# EAGLE design troostite_1.0v (EAGLE 6.5.0)
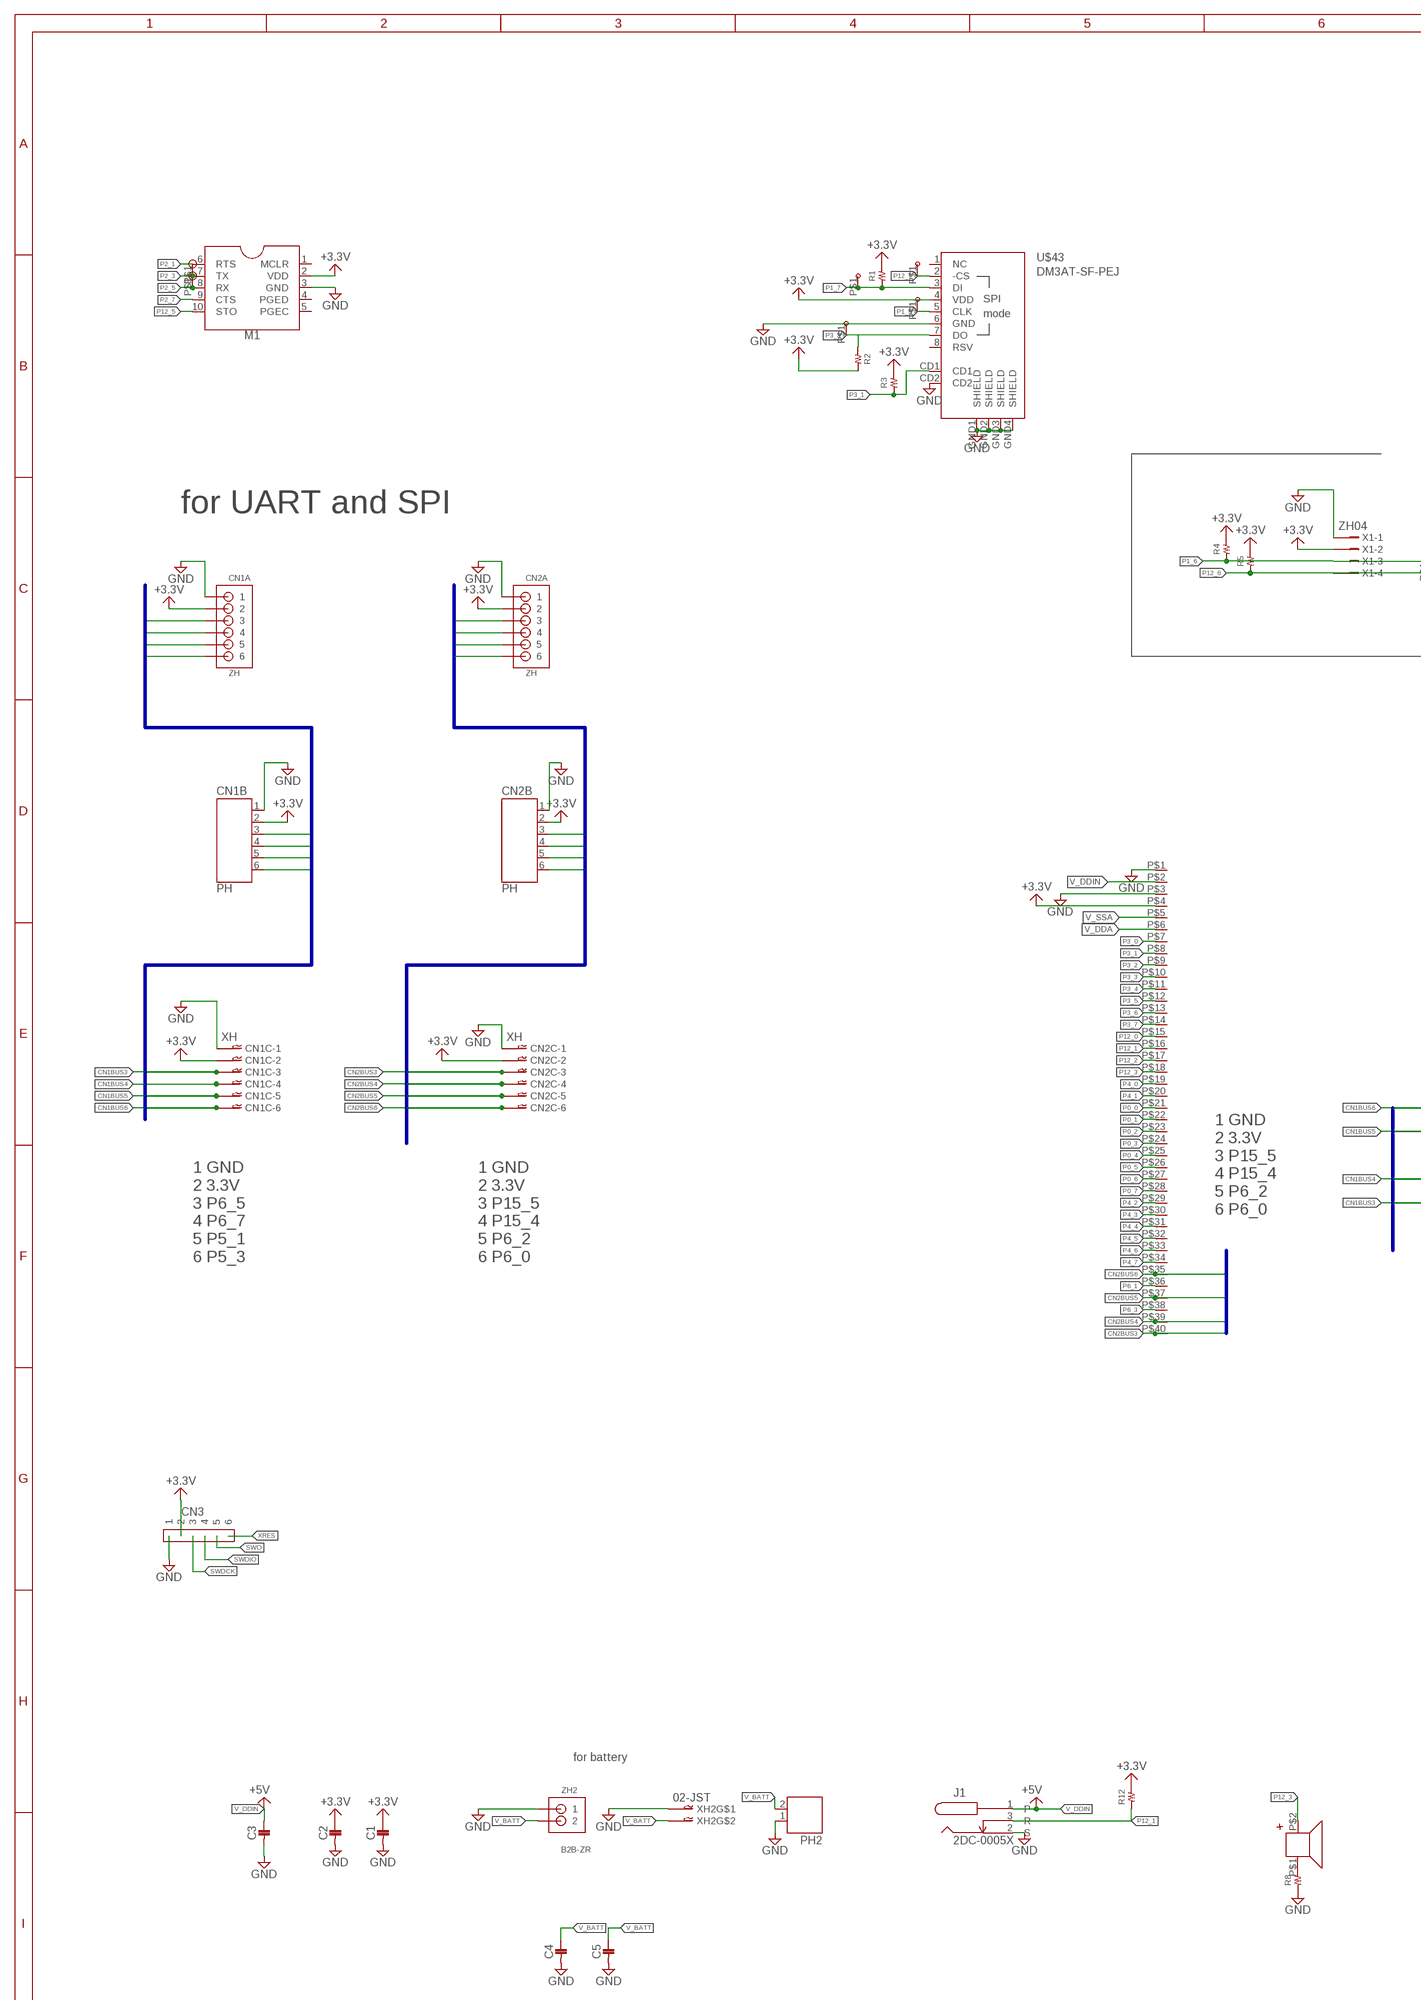
[diagram p0: schematic, sheet 1, part 1 of 2]
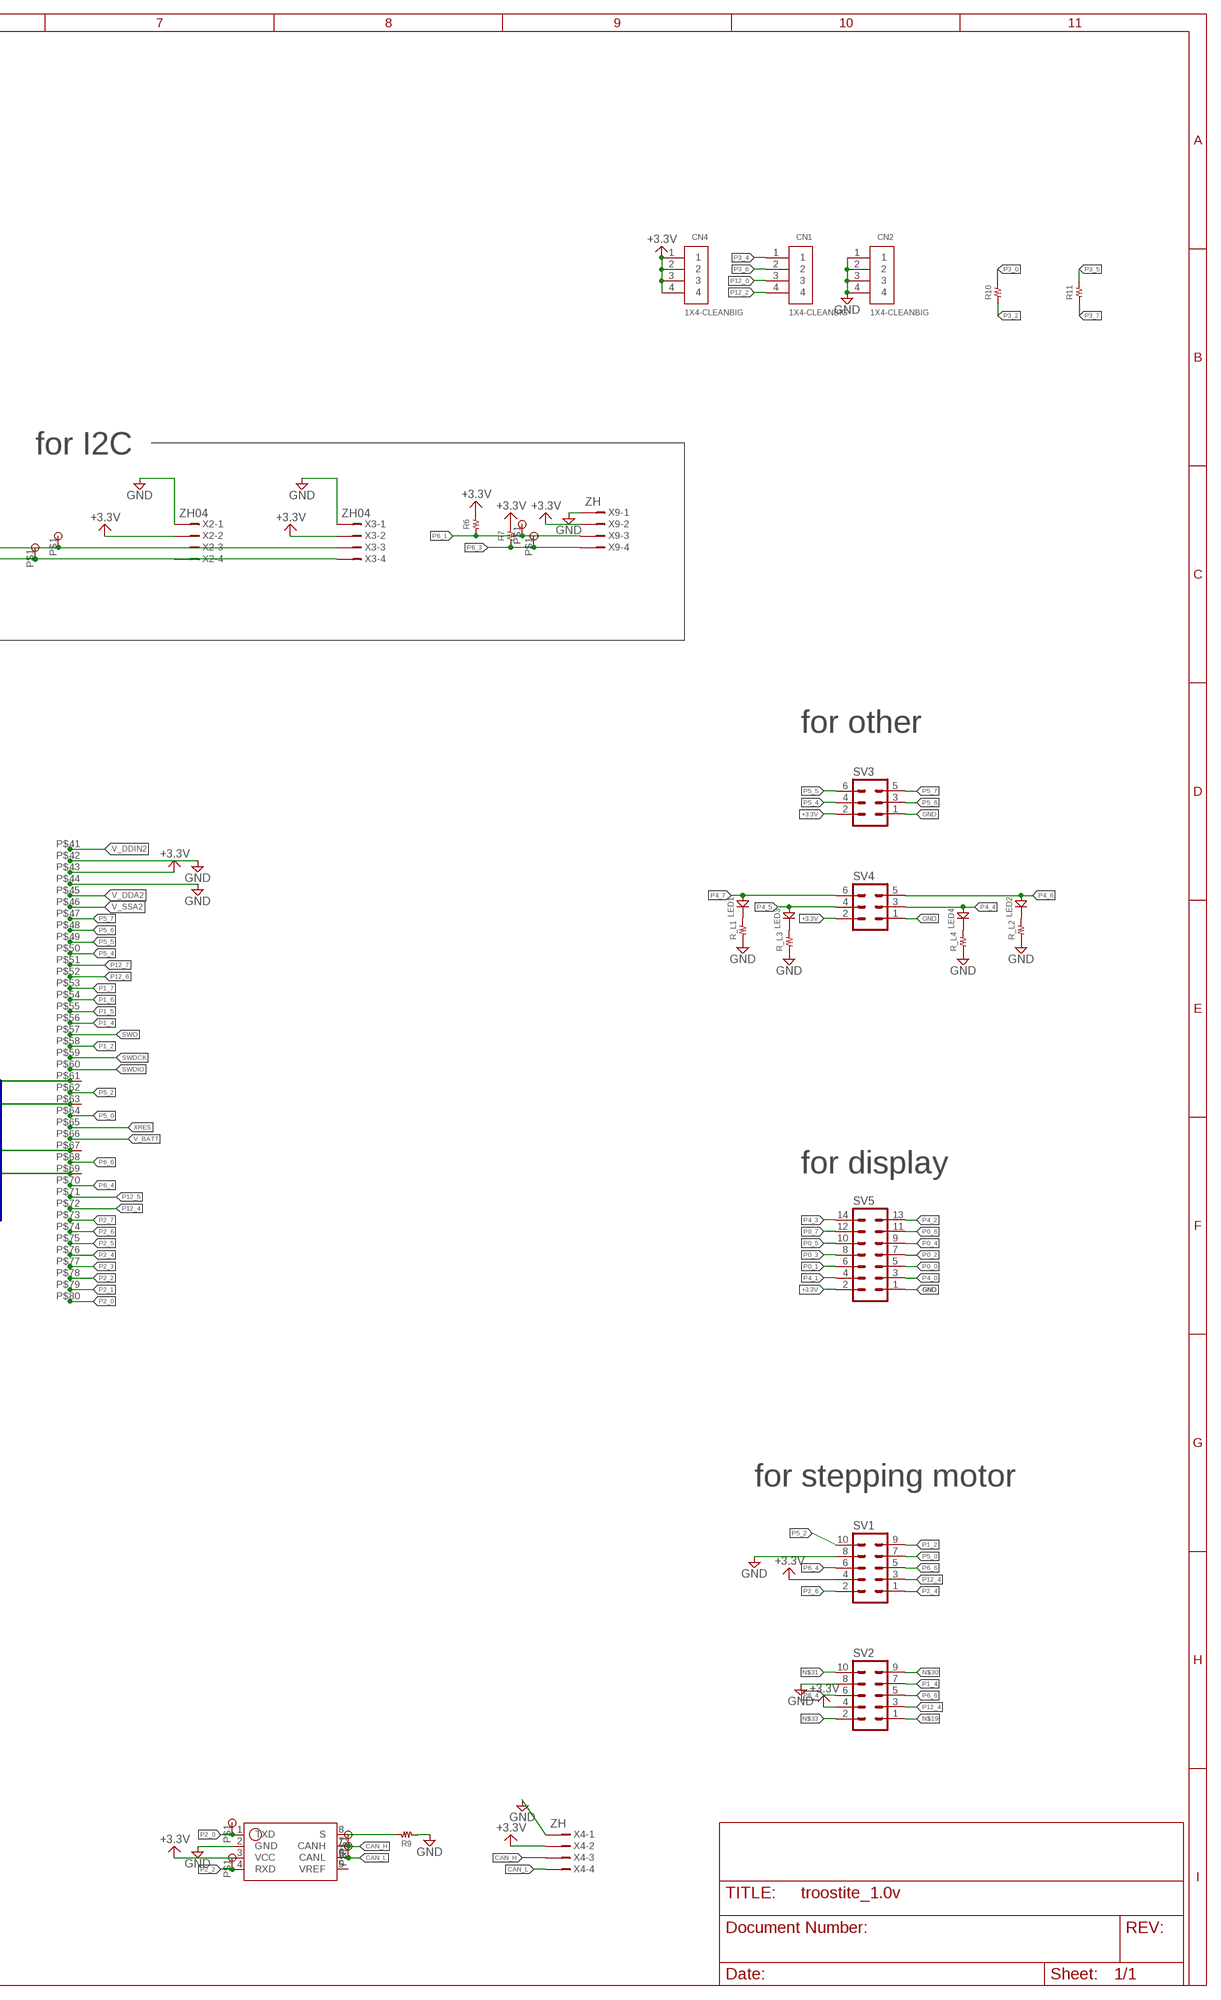
[diagram p1: schematic, sheet 1, part 2 of 2]

## Parts
C1  1608  [1608]
C2  1608  [1608]
C3  1608  [1608]
C4  1608  [1608]
C5  3225  [3225]
CN1  1X4-CLEANBIG  [1X04-CLEANBIG]
CN1A  ZH  B6B-ZR  [B6B-ZR]
CN1B  PH  JST-PH6  [JST-PH6]
CN1C  XH  06-JST-B6B-XH-A  [B6B-XH]
CN2  1X4-CLEANBIG  [1X04-CLEANBIG]
CN2A  ZH  B6B-ZR  [B6B-ZR]
CN2B  PH  JST-PH6  [JST-PH6]
CN2C  XH  06-JST-B6B-XH-A  [B6B-XH]
CN3  PIN_HEADER_6  [PIN_HEADER_6]
CN4  1X4-CLEANBIG  [1X04-CLEANBIG]
IC1  SN65HVD1050  [SOIC8]
J1  2DC-0005X  [2DC-0005D]
LED1  CHIPLED  [1608]
LED2  CHIPLED  [1608]
LED3  CHIPLED  [1608]
LED4  CHIPLED  [1608]
M1  SBDBT  [DIL10]
PH2  JST-PH2  [JST-PH2]
R1  RESISTOR__SMD  [1608]
R2  RESISTOR__SMD  [1608]
R3  RESISTOR__SMD  [1608]
R4  RESISTOR__SMD  [1608]
R5  RESISTOR__SMD  [1608]
R6  RESISTOR__SMD  [1608]
R7  RESISTOR__SMD  [1608]
R8  RESISTOR__SMD  [1608]
R9  RESISTOR__SMD  [1608]
R10  RESISTOR__SMD  [1608]
R11  RESISTOR__SMD  [1608]
R12  RESISTOR__SMD  [1608]
R_L1  RESISTOR__SMD  [1608]
R_L2  RESISTOR__SMD  [1608]
R_L3  RESISTOR__SMD  [1608]
R_L4  RESISTOR__SMD  [1608]
SV1  ML10  [ML10]
SV2  ML10  [ML10]
SV3  ML6  [ML6]
SV4  ML6  [ML6]
SV5  ML14  [ML14]
U$2  PSOC_5LP  [PSOC_5LP]
U$41  PKLCS1212E4001  [PKLCS1212E4001]
U$43  DM3AT-SF-PEJ  [DM3AT-SF-PEJ]
U$72  CHECK_0.8MM  [CHECK_0.8MM]
U$73  CHECK_0.8MM  [CHECK_0.8MM]
U$74  CHECK_0.8MM  [CHECK_0.8MM]
U$75  CHECK_0.8MM  [CHECK_0.8MM]
U$76  CHECK_0.8MM  [CHECK_0.8MM]
U$77  CHECK_0.8MM  [CHECK_0.8MM]
U$78  CHECK_0.8MM  [CHECK_0.8MM]
U$79  CHECK_0.8MM  [CHECK_0.8MM]
U$82  CHECK_0.8MM  [CHECK_0.8MM]
U$83  CHECK_0.8MM  [CHECK_0.8MM]
U$85  CHECK_21.3  [CHECK_2*1.3]
U$86  CHECK_21.3  [CHECK_2*1.3]
U$87  CHECK_21.3  [CHECK_2*1.3]
U$88  CHECK_21.3  [CHECK_2*1.3]
X1  ZH04  B4B-ZR  [B4B-ZR]
X2  ZH04  B4B-ZR  [B4B-ZR]
X3  ZH04  B4B-ZR  [B4B-ZR]
X4  ZH  B4B-ZR  [B4B-ZR]
X9  ZH  B4B-ZR  [B4B-ZR]
XH2  02-JST  [B2B-XH]
ZH2  B2B-ZR  [B2B-ZR]

## Nets
+3.3V: C1.P$1 C2.P$1 CN1A.2 CN1B.2 CN1C.P$2 CN2A.2 CN2B.2 CN2C.P$2 CN3.2 CN4.1 CN4.2 CN4.3 CN4.4 IC1.3(VCC) M1.2(VDD) R1.2 R2.2 R3.2 R4.2 R5.2 R6.2 R7.2 R12.2 SV1.4 SV2.4 SV3.2 SV4.2 SV5.2 U$2.P$4 U$2.P$43 U$43.4(VDD) X1.2 X2.2 X3.2 X4.2 X9.2
CAN_H: IC1.7(CANH) U$72.P$1 X4.3
CAN_L: IC1.6(CANL) U$73.P$1 X4.4
CN1BUS3: CN1A.3 CN1B.3 CN1C.P$3 U$2.P$69
CN1BUS4: CN1A.4 CN1B.4 CN1C.P$4 U$2.P$67
CN1BUS5: CN1A.5 CN1B.5 CN1C.P$5 U$2.P$63
CN1BUS6: CN1A.6 CN1B.6 CN1C.P$6 U$2.P$61
CN2BUS3: CN2A.3 CN2B.3 CN2C.P$3 U$2.P$40
CN2BUS4: CN2A.4 CN2B.4 CN2C.P$4 U$2.P$39
CN2BUS5: CN2A.5 CN2B.5 CN2C.P$5 U$2.P$37
CN2BUS6: CN2A.6 CN2B.6 CN2C.P$6 U$2.P$35
GND: C1.P$2 C2.P$2 C3.P$2 C4.P$2 C5.P$2 CN1A.1 CN1B.1 CN1C.P$1 CN2.1 CN2.2 CN2.3 CN2.4 CN2A.1 CN2B.1 CN2C.P$1 CN3.1 IC1.2(GND) J1.2(S) M1.3(GND) PH2.1 R8.1 R9.1 R_L1.1 R_L2.1 R_L3.1 R_L4.1 SV1.8 SV2.8 SV3.1 SV4.1 SV5.1 U$2.P$1 U$2.P$3 U$2.P$42 U$2.P$44 U$43.6(GND) U$43.CD2 U$43.GND1(SHIELD) U$43.GND2(SHIELD) U$43.GND3(SHIELD) U$43.GND4(SHIELD) X1.1 X2.1 X3.1 X4.1 X9.1 XH2.P$1 ZH2.1
N$1: R8.2 U$41.P$1(MINUS)
N$2: LED1.2(K) R_L1.2
N$3: LED3.2(K) R_L3.2
N$4: LED4.2(K) R_L4.2
N$5: LED2.2(K) R_L2.2
N$7: IC1.8(S) R9.2
N$19: SV2.1
N$30: SV2.9
N$31: SV2.10
N$33: SV2.2
P0_0: SV5.5 U$2.P$21
P0_1: SV5.6 U$2.P$22
P0_2: SV5.7 U$2.P$23
P0_3: SV5.8 U$2.P$24
P0_4: SV5.9 U$2.P$25
P0_5: SV5.10 U$2.P$26
P0_6: SV5.11 U$2.P$27
P0_7: SV5.12 U$2.P$28
P1_2: SV1.9 U$2.P$58
P1_4: SV2.7 U$2.P$56
P1_5: U$2.P$55 U$43.5(CLK) U$87.P$1
P1_6: R4.1 U$2.P$54 U$76.P$1 X1.3 X2.3 X3.3
P1_7: R1.1 U$2.P$53 U$43.3(DI) U$85.P$1
P2_0: IC1.1(TXD) U$2.P$80 U$74.P$1
P2_1: M1.6(RTS) U$2.P$79
P2_2: IC1.4(RXD) U$2.P$78 U$75.P$1
P2_3: M1.7(TX) U$2.P$77 U$82.P$1
P2_4: SV1.1 U$2.P$76
P2_5: M1.8(RX) U$2.P$75 U$83.P$1
P2_6: SV1.2 U$2.P$74
P2_7: M1.9(CTS) U$2.P$73
P3_0: R10.2 U$2.P$7
P3_1: R3.1 U$2.P$8 U$43.CD1
P3_2: R10.1 U$2.P$9
P3_3: R2.1 U$2.P$10 U$43.7(DO) U$88.P$1
P3_4: CN1.1 U$2.P$11
P3_5: R11.2 U$2.P$12
P3_6: CN1.2 U$2.P$13
P3_7: R11.1 U$2.P$14
P4_0: SV5.3 U$2.P$19
P4_1: SV5.4 U$2.P$20
P4_2: SV5.13 U$2.P$29
P4_3: SV5.14 U$2.P$30
P4_4: LED4.1(A) SV4.3 U$2.P$31
P4_5: LED3.1(A) SV4.4 U$2.P$32
P4_6: LED2.1(A) SV4.5 U$2.P$33
P4_7: LED1.1(A) SV4.6 U$2.P$34
P5_0: SV1.7 U$2.P$64
P5_2: SV1.10 U$2.P$62
P5_4: SV3.4 U$2.P$50
P5_5: SV3.6 U$2.P$49
P5_6: SV3.3 U$2.P$48
P5_7: SV3.5 U$2.P$47
P6_1: R6.1 U$2.P$36 U$78.P$1 X9.3
P6_3: R7.1 U$2.P$38 U$79.P$1 X9.4
P6_4: SV1.6 SV2.6 U$2.P$70
P6_6: SV1.5 SV2.5 U$2.P$68
P12_0: CN1.3 U$2.P$15
P12_1: J1.3(R) R12.1 U$2.P$16
P12_2: CN1.4 U$2.P$17
P12_3: U$2.P$18 U$41.P$2(PLUS)
P12_4: SV1.3 SV2.3 U$2.P$72
P12_5: M1.10(STO) U$2.P$71
P12_6: R5.1 U$2.P$52 U$77.P$1 X1.4 X2.4 X3.4
P12_7: U$2.P$51 U$43.2(-CS) U$86.P$1
SWDCK: CN3.3 U$2.P$59
SWDIO: CN3.4 U$2.P$60
SWO: CN3.5 U$2.P$57
V_BATT: C4.P$1 C5.P$1 PH2.2 U$2.P$66 XH2.P$2 ZH2.2
V_DDA: U$2.P$6
V_DDA2: U$2.P$45
V_DDIN: C3.P$1 J1.1(P) U$2.P$2 ; supply symbol labelled +5V
V_DDIN2: U$2.P$41
V_SSA: U$2.P$5
V_SSA2: U$2.P$46
XRES: CN3.6 U$2.P$65
Unconnected: IC1.5(VREF) M1.1(MCLR) M1.4(PGED) M1.5(PGEC) U$43.1(NC) U$43.8(RSV)

## Buses
CN1BUS[3..6]
CN2BUS[3..6]

## Notes on the sheet
- for I2C
- for UART and SPI
- for other
- for display
- 1 GND
  2 3.3V
  3 P15_5
  4 P15_4
  5 P6_2
  6 P6_0
- 1 GND
  2 3.3V
  3 P6_5
  4 P6_7
  5 P5_1
  6 P5_3
- 1 GND
  2 3.3V
  3 P15_5
  4 P15_4
  5 P6_2
  6 P6_0
- for stepping motor
- for battery

## Library data of the parts
C1-C4 = 02_C:1608
C5 = 02_C:3225
CN1 CN2 CN4 = adafruit:1X4: 4-pin connector
CN1A CN2A = jst:B6B-ZR: JST-ZH Connector 6 pol, 1.5mm pitch Package: B6B-ZR Source: http://www.jst-mfg.com/product/pdf/eng/eZH.pdf
CN1B CN2B = jst-ph:JST-PH6
CN1C CN2C = con-jst-xh:06-JST: JST CONNECTOR
CN3 = 08_CONECTOR:PIN_HEADER_6
IC1 = 04_IC:SN65HVD1050
J1 = marushin:2DC-0005X
LED1-LED4 = 10_LED:CHIPLED
M1 = 12_module:SBDBT
PH2 = jst-ph:JST-PH2
R1-R12 R_L1-R_L4 = 01_R:RESISTOR__SMD
SV1 SV2 = con-ml:ML10: HARTING; OC_FARNELL: unknown; OC_NEWARK: unknown
SV3 SV4 = con-ml:ML6: HARTING; OC_FARNELL: unknown; OC_NEWARK: unknown
SV5 = con-ml:ML14: HARTING; OC_FARNELL: unknown; OC_NEWARK: unknown
U$2 = 12_module:PSOC_5LP
U$41 = 13_SPEAKER:PKLCS1212E4001
U$43 = sd-card:DM3AT-SF-PEJ: HIROSE microSD socket DM3AT-SF-PEJ
U$72-U$79 U$82 U$83 = 08_CONECTOR:CHECK_0.8MM
U$85-U$88 = 08_CONECTOR:CHECK_2*1.3
X1-X4 X9 = con-jst:?4B-ZR: ZH CONNECTOR 1.5 mm, 4 pin 1 row Source: http://www.jst.com .. eZH.pdf; MF: FARNELL; MPN: B4B-ZR(LF)(SN); OC_FARNELL: 1830916; OC_NEWARK: 37K9960
XH2 = con-jst-xh:02-JST
ZH2 = jst:B2B-ZR

## Net classes
0 default: width 0.3 mm

## Board
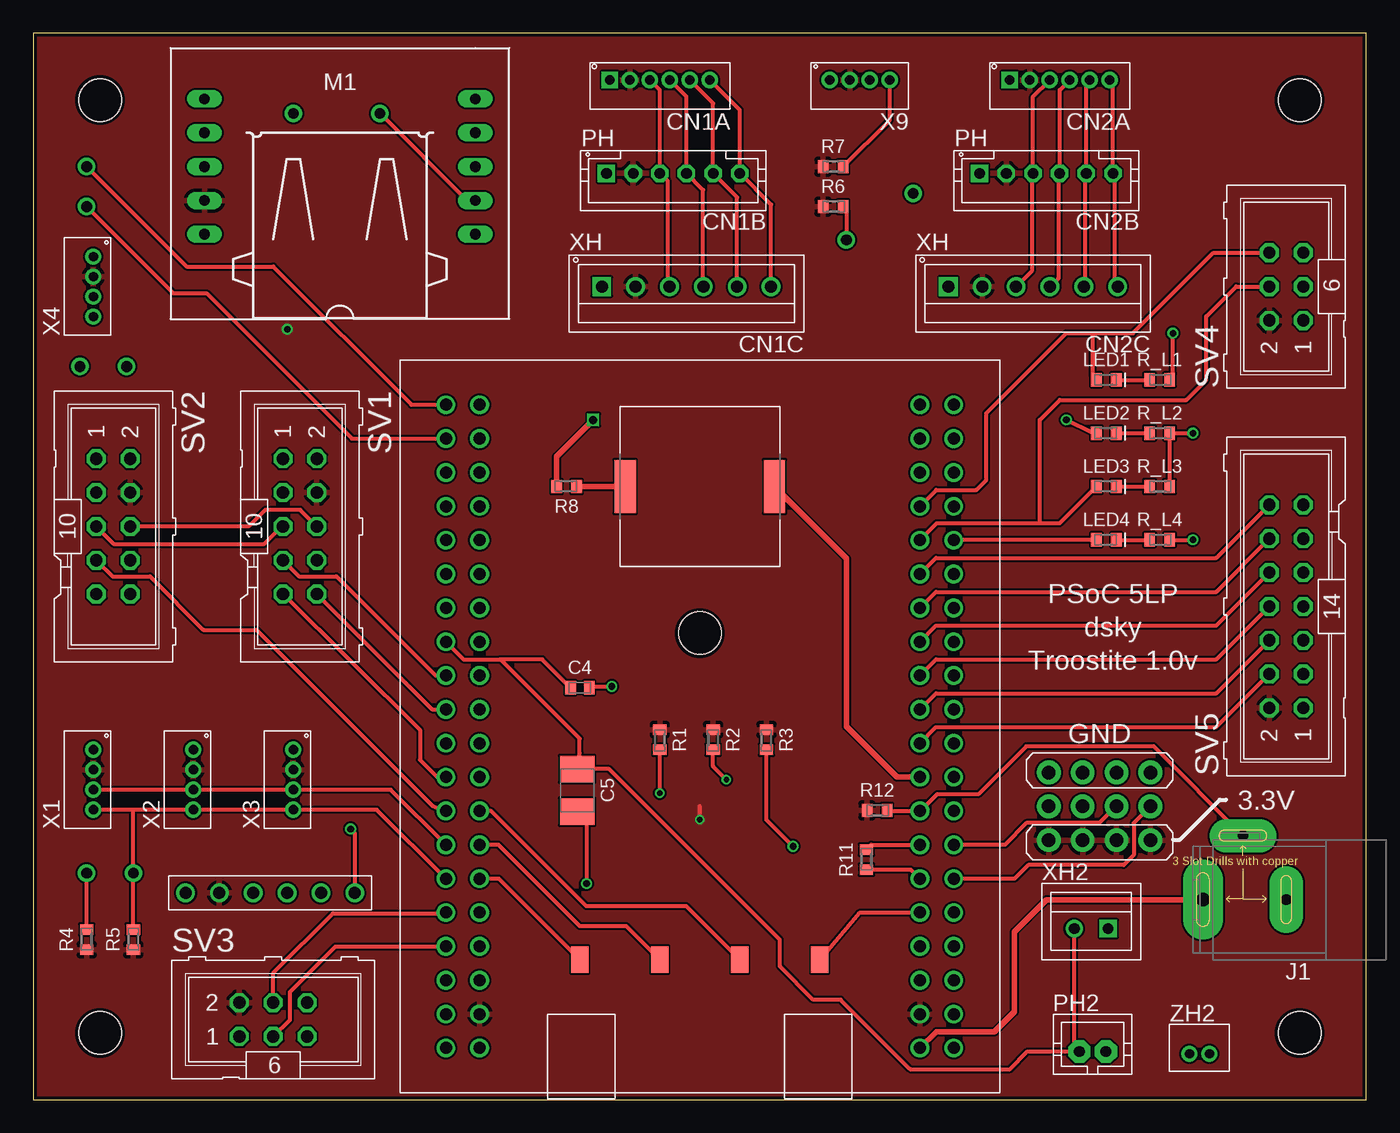
[diagram p2: board, top side]
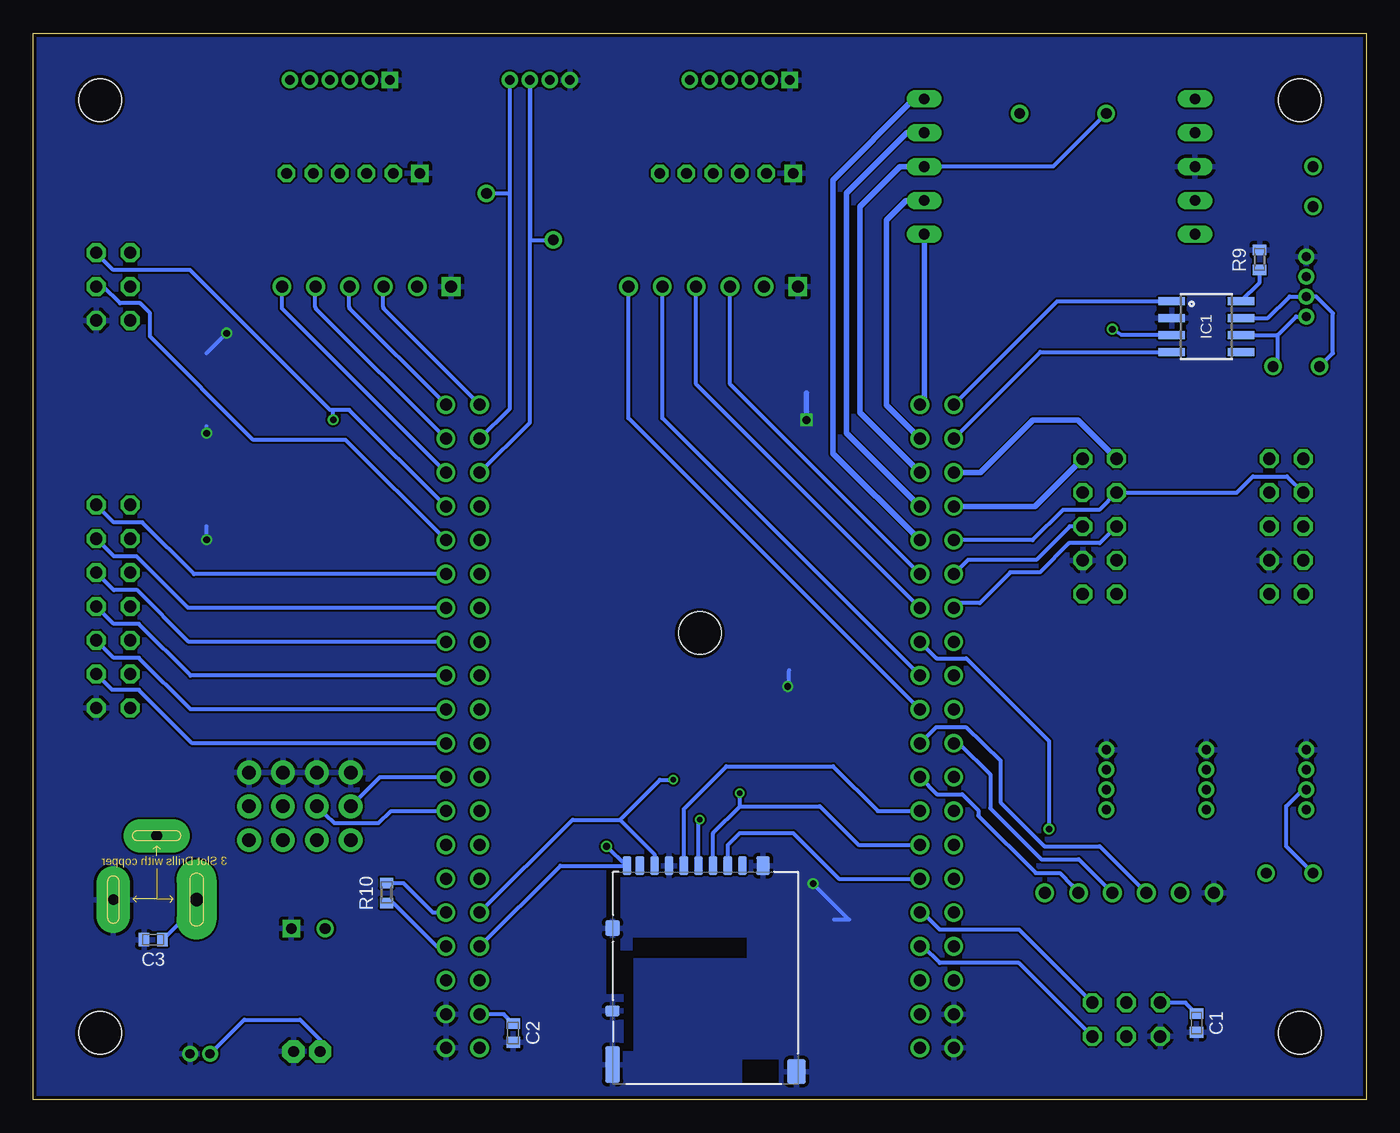
[diagram p3: board, bottom side, seen from below]

Size 100 x 80 mm. Coordinates in mm from the lower left corner, seen from the top.
Outline: 0,0 100,0 100,80 0,80 0,0
Copper layers (1*16): Top 0.035mm / dielectric 1.5mm / Bottom 0.035mm
Design rules "SeeedStudio_2layer_DRU_no_angle_20140221 *": minimum track width 6mil, minimum drill 12mil, track to track 6mil, track to pad 6mil, pad to pad 6mil, via to via 6mil, smd to smd 0mil, copper to edge 10mil, drill to drill 10mil, minimum pad ring 10mil, minimum via ring 6mil, stop-mask expansion 2mil, vias tented up to drill 0.51mm, thermal gap 10mil
Holes 3.2 mm at 5,5 5,75 95,5 95,75 50,35
tKeepout: area 2,2 to 8,8; area 92,2 to 98,8; area 92,72 to 98,78; area 2,72 to 8,78; area 47,32 to 53,38

### Footprints (pad centres in the part's own frame; a part is rotated, then mirrored left to right if it is on the bottom)
1608 = smd 0.8 x 1: P$1 -0.7,0; P$2 0.7,0
3225 = smd 2 x 2.6: P$1 -1.6,0; P$2 1.6,0
1X04-CLEANBIG = drill 1.016 pad 1.778: 1 -3.81,0; 2 -1.27,0; 3 1.27,0; 4 3.81,0
B6B-ZR = drill 0.7 square: 1 3.75,0 | drill 0.7: 2 2.25,0; 3 0.75,0; 4 -0.75,0; 5 -2.25,0; 6 -3.75,0
JST-PH6 = drill 0.8 square: 1 5,0 | drill 0.8 octagon: 2 3,0; 3 1,0; 4 -1,0; 5 -3,0; 6 -5,0
B6B-XH = drill 0.9 square: P$1 6.35,0 | drill 0.9: P$2 3.81,0; P$3 1.27,0; P$4 -1.27,0; P$5 -3.81,0; P$6 -6.35,0
PIN_HEADER_6 = drill 0.9: 1 -5.08,0; 2 -2.54,0; 3 0,0; 4 2.54,0; 5 5.08,0; 6 7.62,0
SOIC8 = smd 0.6 x 2: 1 -1.905,-2.6; 2 -0.635,-2.6; 3 0.635,-2.6; 4 1.905,-2.6; 5 1.905,2.6; 6 0.635,2.6; 7 -0.635,2.6; 8 -1.905,2.6
2DC-0005D = drill 1 pad 3 long: 1 6.25,0 | drill 0.8 pad 2.5 long: 2 0,0; 3 3.25,-4.8
1608' = smd 0.8 x 1: 1 -0.75,0; 2 0.75,0
DIL10 = drill 0.813 long: 1 10.16,5.08; 2 10.16,2.54; 3 10.16,0; 4 10.16,-2.54; 5 10.16,-5.08; 6 -10.16,5.08; 7 -10.16,2.54; 8 -10.16,0; 9 -10.16,-2.54; 10 -10.16,-5.08
JST-PH2 = drill 0.813 pad 1.676 octagon: 1 1,0; 2 -1,0
ML10 = drill 0.914 octagon: 1 -5.08,-1.27; 2 -5.08,1.27; 3 -2.54,-1.27; 4 -2.54,1.27; 5 0,-1.27; 6 0,1.27; 7 2.54,-1.27; 8 2.54,1.27; 9 5.08,-1.27; 10 5.08,1.27
ML6 = drill 0.914 octagon: 1 -2.54,-1.27; 2 -2.54,1.27; 3 0,-1.27; 4 0,1.27; 5 2.54,-1.27; 6 2.54,1.27
ML14 = drill 0.914 octagon: 1 -7.62,-1.27; 2 -7.62,1.27; 3 -5.08,-1.27; 4 -5.08,1.27; 5 -2.54,-1.27; 6 -2.54,1.27; 7 0,-1.27; 8 0,1.27; 9 2.54,-1.27; 10 2.54,1.27; 11 5.08,-1.27; 12 5.08,1.27; 13 7.62,-1.27; 14 7.62,1.27
PSOC_5LP = drill 0.9: P$1 -19.05,24.13; P$2 -16.51,24.13; P$3 -19.05,21.59; P$4 -16.51,21.59; P$5 -19.05,19.05; P$6 -16.51,19.05; P$7 -19.05,16.51; P$8 -16.51,16.51; P$9 -19.05,13.97; P$10 -16.51,13.97; P$11 -19.05,11.43; P$12 -16.51,11.43; P$13 -19.05,8.89; P$14 -16.51,8.89; P$15 -19.05,6.35; P$16 -16.51,6.35; P$17 -19.05,3.81; P$18 -16.51,3.81; P$19 -19.05,1.27; P$20 -16.51,1.27; P$21 -19.05,-1.27; P$22 -16.51,-1.27; P$23 -19.05,-3.81; P$24 -16.51,-3.81; P$25 -19.05,-6.35; P$26 -16.51,-6.35; P$27 -19.05,-8.89; P$28 -16.51,-8.89; P$29 -19.05,-11.43; P$30 -16.51,-11.43; P$31 -19.05,-13.97; P$32 -16.51,-13.97; P$33 -19.05,-16.51; P$34 -16.51,-16.51; P$35 -19.05,-19.05; P$36 -16.51,-19.05; P$37 -19.05,-21.59; P$38 -16.51,-21.59; P$39 -19.05,-24.13; P$40 -16.51,-24.13; P$41 16.51,24.13; P$42 19.05,24.13; P$43 16.51,21.59; P$44 19.05,21.59; P$45 16.51,19.05; P$46 19.05,19.05; P$47 16.51,16.51; P$48 19.05,16.51; P$49 16.51,13.97; P$50 19.05,13.97; P$51 16.51,11.43; P$52 19.05,11.43; P$53 16.51,8.89; P$54 19.05,8.89; P$55 16.51,6.35; P$56 19.05,6.35; P$57 16.51,3.81; P$58 19.05,3.81; P$59 16.51,1.27; P$60 19.05,1.27; P$61 16.51,-1.27; P$62 19.05,-1.27; P$63 16.51,-3.81; P$64 19.05,-3.81; P$65 16.51,-6.35; P$66 19.05,-6.35; P$67 16.51,-8.89; P$68 19.05,-8.89; P$69 16.51,-11.43; P$70 19.05,-11.43; P$71 16.51,-13.97; P$72 19.05,-13.97; P$73 16.51,-16.51; P$74 19.05,-16.51; P$75 16.51,-19.05; P$76 19.05,-19.05; P$77 16.51,-21.59; P$78 19.05,-21.59; P$79 16.51,-24.13; P$80 19.05,-24.13
PKLCS1212E4001 = smd 1.6 x 4: P$1 -5.6,0; P$2 5.6,0
DM3AT-SF-PEJ = smd 0.65 x 1.4: 1 3.2,16.4; 2 2.1,16.4; 3 1,16.4; 4 -0.1,16.4; 5 -1.2,16.4; 6 -2.3,16.4; 7 -3.4,16.4; 8 -4.5,16.4; CD1 -5.45,16.4 | smd 1.1 x 0.8: CD2 -6.55,5.5 | smd 1.1 x 2.8: GND1 -6.55,1.475 | smd 1.4 x 1.9: GND2 7.25,0.95 | smd 1 x 1.4: GND3 4.75,16.4 | smd 1.1 x 1.2: GND4 -6.55,11.7
CHECK_0.8MM = drill 0.8: P$1 0,0
CHECK_2*1.3 = smd 1.3 x 2: P$1 0,0
B4B-ZR = drill 0.7 pad 1.1: 1 2.25,0; 2 0.75,0; 3 -0.75,0; 4 -2.25,0
B2B-XH = drill 0.8 square: P$1 0,0 | drill 0.8: P$2 -2.54,0
B2B-ZR = drill 0.7 pad 1.1: 1 -1.5,0; 2 0,0

### Placement (x,y rotation side)
C1  12.73,5.74 270 bottom
C2  64,5 270 bottom
C3  91,12 180 bottom
C4  41,30.9 0 top
C5  40.8,23.2 270 top
CN1  80,22 180 top
CN1A  47,76.5 180 top
CN1B  48,69.5 180 top
CN1C  49,61 180 top
CN2  80,24.54 180 top
CN2A  77,76.5 180 top
CN2B  76,69.5 180 top
CN2C  75,61 180 top
CN3  16.5,15.5 0 top
CN4  80,19.46 0 top
IC1  12,58 270 bottom
J1  94,15 180 top
LED1  CHIPLED  [1608']  80.5,54 0 top
LED2  CHIPLED  [1608']  80.5,50 0 top
LED3  CHIPLED  [1608']  80.5,46 0 top
LED4  CHIPLED  [1608']  80.5,42 0 top
M1  23,70 180 top
PH2  79.48,3.6 0 top
R1  [1608']  47,27 90 top
R2  [1608']  51,27 90 top
R3  [1608']  55,27 90 top
R4  [1608']  4,12 270 top
R5  [1608']  7.5,12 270 top
R6  [1608']  60,67 180 top
R7  [1608']  60,70 180 top
R8  [1608']  40,46 0 top
R9  [1608']  8,63 270 bottom
R10  [1608']  73.5,15.5 270 bottom
R11  [1608']  62.5,18 270 top
R12  [1608']  63.3,21.7 180 top
R_L1  [1608']  84.5,54 180 top
R_L2  [1608']  84.5,50 180 top
R_L3  [1608']  84.5,46 180 top
R_L4  [1608']  84.5,42 180 top
SV1  20,43 270 top
SV2  6,43 270 top
SV3  18,6 0 top
SV4  94,61 90 top
SV5  94,37 90 top
U$2  50,28 180 top
U$41  50,46 0 top
U$43  50,1.15 0 bottom
U$72  3.5,55 0 top
U$73  7,55 0 top
U$74  4,70 0 top
U$75  4,67 0 top
U$76  4,17 0 top
U$77  7.5,17 0 top
U$78  61,64.5 0 top
U$79  66,68 0 top
U$82  26,74 0 top
U$83  19.5,74 0 top
U$85  47,10.5 0 top
U$86  41,10.5 0 top
U$87  53,10.5 0 top
U$88  59,10.5 0 top
X1  4.5,24 90 top
X2  12,24 90 top
X3  19.5,24 90 top
X4  4.5,61 90 top
X9  62,76.5 180 top
XH2  80.64,12.83 0 top
ZH2  86.74,3.43 180 top

### Tracks (layer width: path | path; a pad name or v marks a point on that pad's centre or on a via)
+3.3V  (via drill 0.4, 0.5)
  Top 0.3: v50,21 50,22
  Bottom 0.3: C1.P$1 13.56,7.27 SV3.2 | U$43.4 50.1,20.9 v50,21 | IC1.3 18.36,57.37 v19.05,57.8 | C2.P$1 64.71,6.41 U$2.P$4
  pour Top: 0,80 100,80 100,0 0,0
CAN_H
  Bottom 0.3: IC1.7 7.37,58.63 5.75,60.25 X4.3 3.75,60.25 2.5,59 2.5,56 U$72.P$1
CAN_L
  Bottom 0.3: IC1.6 6.63,57.37 | 6.63,57.37 5.25,58.75 X4.4 | U$73.P$1 6.63,55.37 6.63,57.37
CN1BUS3
  Top 0.3: 47.7,61 CN1C.P$3 47.6,61.1 47.6,68.9 CN1B.3 47,75.75 CN1A.3
  Bottom 0.3: U$2.P$69 47.73,53.67 CN1C.P$3
CN1BUS4
  Top 0.3: CN1A.4 49,75.25 CN1B.4 50.25,68.25 50.25,61 CN1C.P$4
  Bottom 0.3: U$2.P$67 50.27,53.67 CN1C.P$4
CN1BUS5
  Top 0.3: CN1A.5 51,74.75 CN1B.5 52.8,67.7 CN1C.P$5
  Bottom 0.3: U$2.P$63 52.81,51.13 CN1C.P$5
CN1BUS6
  Top 0.3: CN1A.6 53,74.25 CN1B.6 55.35,67.15 CN1C.P$6
  Bottom 0.3: U$2.P$61 55.35,51.13 CN1C.P$6
CN2BUS3
  Top 0.3: CN2A.3 75,75.25 CN2B.3 74.9,69.4 74.9,62.15 73.75,61 CN2C.P$3
  Bottom 0.3: U$2.P$40 73.73,59.35 73.75,59.45 73.75,61 CN2C.P$3
CN2BUS4
  Top 0.3: CN2A.4 77,75.75 CN2B.4 76.9,69.4 76.9,61.6 76.3,61 CN2C.P$4
  Bottom 0.3: U$2.P$39 76.27,59.35 76.3,59.45 76.3,61 CN2C.P$4
CN2BUS5
  Top 0.3: CN2A.5 79,76.25 CN2B.5 78.9,69.4 78.9,61.05 78.85,61 CN2C.P$5
  Bottom 0.3: U$2.P$37 78.81,59.35 78.85,59.45 78.85,61 CN2C.P$5
CN2BUS6
  Top 0.3: CN2A.6 81,76.25 CN2B.6 81.1,69.4 81.1,61.25 CN2C.P$6
  Bottom 0.3: U$2.P$35 81.35,59.35 CN2C.P$6
GND  (via drill 0.5, 0.6)
  Top 0.3: R_L3.1 R_L2.1 v87,50 | R_L1.1 85.25,54.25 85.5,54.5 v85.5,57.5 | R_L4.1 v87,42 | C4.P$2 41.8,31 v43.4,31 | C5.P$2 41.5,21.3 v41.5,16.2
  Top 0.4: R8.1 39.25,48.25 v42,51
  Bottom 0.3: v87,50 87,50.5 | v85.5,57.5 87,56 | v87,42 87,43 | v43.4,31 43.3,31.1 43.3,32.2 | v41.5,16.2 38.8,13.5 39.9,13.5
  Bottom 0.4: v42,51 42,53
  pour Bottom: 0,80 100,80 100,0 0,0
N$1
  Top 0.4: U$41.P$1 R8.2
N$2
  Top 0.3: LED1.2 R_L1.2
N$3
  Top 0.3: LED3.2 R_L3.2
N$4
  Top 0.3: LED4.2 R_L4.2
N$5
  Top 0.3: LED2.2 R_L2.2
N$7
  Bottom 0.3: IC1.8 8,61.3 R9.2
P0_0
  Bottom 0.3: U$2.P$21 88.2,29.27 92.08,33.15 93.96,33.15 SV5.5
P0_1
  Top 0.3: U$2.P$22 67.72,30.48 88.75,30.48 SV5.6
P0_2
  Bottom 0.3: U$2.P$23 88.2,31.81 92.08,35.69 93.96,35.69 SV5.7
P0_3
  Top 0.3: U$2.P$24 67.72,33.02 88.75,33.02 SV5.8
P0_4
  Bottom 0.3: U$2.P$25 88.33,34.35 92.2,38.23 93.96,38.23 SV5.9
P0_5
  Top 0.3: U$2.P$26 67.72,35.56 88.75,35.56 SV5.10
P0_6
  Bottom 0.3: U$2.P$27 88.39,36.89 92.25,40.75 93.94,40.75 SV5.11
P0_7
  Top 0.3: U$2.P$28 67.72,38.1 88.75,38.1 SV5.12
P1_2
  Top 0.3: SV1.9 29,27.75 29,25.5 30.31,24.19 U$2.P$58
P1_4
  Top 0.3: SV2.7 5.94,39.25 8.75,39.25 12.75,35.25 16.75,35.25 29.95,22.05 U$2.P$56
P1_5
  Top 0.3: U$87.P$1 49,14.5 41.5,14.5 34.35,21.65 U$2.P$55
  Bottom 0.3: U$43.5 51.2,21.8 48,25 40,25 36.65,21.65 U$2.P$55
P1_6
  Top 0.3: U$2.P$54 26.81,23.25 X3.3 X2.3 X1.3 | R4.1 U$76.P$1
  Bottom 0.3: U$76.P$1 6,19 6,22 4.75,23.25 X1.3
P1_7  (via drill 0.4)
  Top 0.3: v47,23 R1.1 | U$85.P$1 44.5,13 41,13 34.89,19.11 U$2.P$53
  Bottom 0.3: U$43.3 49,20 47,22 | 47,22 41,22 38.11,19.11 U$2.P$53 | 47,22 v47,23
P2_0
  Top 0.3: U$74.P$1 11.5,62.5 18,62.5 28.37,52.13 U$2.P$80
  Bottom 0.3: U$2.P$80 23.18,59.91 IC1.1
P2_1
  Bottom 0.4: U$2.P$79 33.16,52.13 M1.6
P2_2
  Top 0.3: U$75.P$1 10.5,60.5 13,60.5 23,50.5 23.91,49.59 U$2.P$78
  Bottom 0.3: U$2.P$78 24.45,56.09 IC1.4
P2_3
  Top 0.3: U$82.P$1 32.54,67.46 M1.7
  Bottom 0.4: U$2.P$77 36,52.1 36,66 34.54,67.46 M1.7
P2_4
  Bottom 0.4: SV1.1 21.65,51 25,51 28.95,47.05 U$2.P$76
P2_5
  Bottom 0.3: U$83.P$1 23.5,70 M1.8
  Bottom 0.4: U$2.P$75 38,51.56 38,67 35,70 M1.8
P2_6
  Bottom 0.4: SV1.2 24.84,44.51 U$2.P$74
P2_7
  Bottom 0.4: U$2.P$73 39,50.02 39,68 34.46,72.54 M1.9
P3_0
  Bottom 0.3: U$2.P$7 69.74,11.49 73,14.75 R10.2
P3_1  (via drill 0.5)
  Top 0.3: v57,19 55,21 R3.1
  Bottom 0.3: U$2.P$8 60.45,17.55 U$43.CD1 57,18.95 v57,19
P3_2
  Bottom 0.3: R10.1 72.25,16.25 70.03,14.03 U$2.P$9
P3_3  (via drill 0.4)
  Top 0.3: v52,24 51,25 R2.1 | U$88.P$1 62.03,14.03 U$2.P$10
  Bottom 0.3: U$2.P$10 59.54,21 56,21 | 56,21 53.4,18.4 U$43.7 | 56,21 53,24 v52,24
P3_4
  Top 0.3: CN1.1 82.55,20.74 82.55,18.35 81.8,17.6 74.65,17.6 73.62,16.57 U$2.P$11
P3_5
  Top 0.3: U$2.P$12 65.83,17.25 R11.2
P3_6
  Top 0.3: CN1.2 79.97,20.75 74.5,20.75 72.91,19.11 U$2.P$13
P3_7
  Top 0.3: R11.1 62.86,19.11 U$2.P$14
P4_0
  Bottom 0.3: U$2.P$19 88.07,26.73 92.08,30.73 94.08,30.73 SV5.3
P4_1
  Top 0.3: U$2.P$20 67.72,27.94 88.75,27.94 SV5.4
P4_2
  Bottom 0.3: U$2.P$29 87.94,39.43 91.82,43.31 93.96,43.31 SV5.13
P4_3
  Top 0.3: U$2.P$30 67.72,40.64 88.75,40.64 SV5.14
P4_4
  Top 0.3: LED4.1 69.08,42 U$2.P$31
  Bottom 0.3: U$2.P$31 76.58,49.5 83.5,49.5 91.25,57.25 91.25,59 92,59.75 93.5,59.75 94.75,61 SV4.3
P4_5
  Top 0.3: U$2.P$32 67.79,43.25 75.5,43.25 | 75.5,43.25 77,43.25 LED3.1 | SV4.4 90.25,61 88,58.75 88,54 86.5,52.5 77,52.5 75.5,51 75.5,43.25
  Bottom 0.3: SV4.4 92.25,61
P4_6  (via drill 0.5)
  Top 0.3: LED2.1 79.5,50 v77.5,51
  Bottom 0.3: U$2.P$33 76.29,51.75 77.5,51.75 | 77.5,51.75 77.75,51.75 88.25,62.25 94,62.25 95.27,63.52 SV4.5 | v77.5,51 77.5,51.75
P4_7
  Top 0.3: U$2.P$34 67.75,45.75 70.75,45.75 71.5,46.5 71.5,51.5 77.5,57.5 79.5,57.5 | 79.5,57.5 82.5,57.5 88.54,63.54 SV4.6 | LED1.1 79.5,54.25 79.5,57.5
P5_0
  Top 0.3: SV1.7 19.94,39.25 22.75,39.25 30.19,31.81 U$2.P$64
P5_2
  Top 0.3: SV1.10 29.92,29.27 U$2.P$62
P5_4
  Top 0.3: SV3.4 18,9.49 22.48,13.97 30.89,13.97 U$2.P$50
P5_5
  Bottom 0.3: SV3.6 26.02,12.75 32,12.75 33.28,14.03 U$2.P$49
P5_6
  Top 0.3: SV3.3 19.25,5.98 19.25,8.07 22.67,11.49 U$2.P$48
P5_7
  Bottom 0.3: SV3.5 26.06,10.25 32,10.25 33.24,11.49 U$2.P$47
P6_1
  Top 0.3: R6.1 61,66.75 U$78.P$1
  Bottom 0.3: U$2.P$36 62.75,50.81 X9.3 62.75,64.5 U$78.P$1
P6_3
  Top 0.3: R7.1 64.25,73.5 X9.4
  Bottom 0.3: U$2.P$38 64.25,51.85 64.25,68 | 64.25,68 X9.4 | U$79.P$1 64.25,68
P6_4
  Top 0.3: SV1.6 20.02,44.25 17.4,44.25 16.15,43 SV2.6
  Bottom 0.3: SV1.6 22.25,43 24.75,40.5 29.88,40.5 U$2.P$70
P6_6
  Top 0.3: SV1.5 18.62,43 17.27,41.66 6.07,41.66 SV2.5
  Bottom 0.3: SV1.5 18.75,43 20,41.75 22.3,41.75 24.5,39.55 26.7,39.55 29,37.25 30.59,37.25 U$2.P$68
P12_0
  Bottom 0.3: CN1.3 77.43,20.75 74.1,20.75 73.15,21.65 U$2.P$15
P12_1
  Top 0.3: J1.3 84.05,26.5 74.5,26.5 70.9,22.9 67.8,22.9 66.55,21.65 U$2.P$16 64.1,21.65 R12.1
P12_2
  Bottom 0.3: CN1.4 74,24.19 U$2.P$17
P12_3
  Top 0.4: U$2.P$18 64.81,24.19 61,28 61,40.6 U$41.P$2
P12_4
  Bottom 0.3: U$2.P$72 25.03,41.97 22.75,44.25 20.02,44.25 SV1.3 9.71,45.54 8.5,46.75 5.94,46.75 SV2.3
P12_5
  Bottom 0.4: U$2.P$71 40,48.48 40,69 33.92,75.08 M1.10
P12_6
  Top 0.3: U$2.P$52 25.77,21.75 X3.4 X2.4 7.5,21.75 | 7.5,21.75 X1.4 | 7.5,21.75 U$77.P$1 R5.1
P12_7
  Top 0.3: U$86.P$1 34.93,16.57 U$2.P$51
  Bottom 0.3: U$43.2 47.9,19.1 47,20 43,20 39.57,16.57 U$2.P$51
SWDCK
  Bottom 0.3: U$2.P$59 33.47,26.73 32.26,27.94 30.03,27.94 27.43,25.44 27.43,22.3 24.13,19 20,19 CN3.3
SWDIO
  Bottom 0.3: U$2.P$60 30.54,26.73 28.19,24.38 28.19,21.84 24.38,18.03 21.57,18.03 CN3.4
SWO
  Bottom 0.3: U$2.P$57 32.2,22.9 30.3,22.9 29.1,21.7 29.1,21.3 24.8,17 23,17 22.08,16.08 CN3.5
V_BATT
  Top 0.3: U$2.P$66 32.28,33.02 35.05,33.02 | 35.05,33.02 40.99,27.09 40.99,25.99 C5.P$1 43.2,24.8 56,12 56,10 58.5,7.5 60.57,7.5 65.79,2.29 73.28,2.29 74.59,3.6 PH2.2 78.11,3.97 XH2.P$2 | C4.P$1 38.18,33.02 35.05,33.02
  Bottom 0.3: ZH2.2 84.17,6 80,6 78.48,4.48 PH2.2
V_DDIN
  Top 0.4: U$2.P$2 67.74,5.1 72.1,5.1 73.6,6.6 73.6,12.6 76,15 J1.1
  Bottom 0.3: C3.P$1 87.75,14.55 J1.1
XRES  (via drill 0.5)
  Top 0.3: v23.8,20.3 24.12,19.98 CN3.6
  Bottom 0.3: U$2.P$65 32.24,33.1 30,33.1 23.8,26.9 v23.8,20.3

### Text on the board
tPlace: PSoC 5LP | dsky | Troostite 1.0v | GND | 3.3V